# EAGLE board All Modules (EAGLE 9.5.1), part 1 of 2
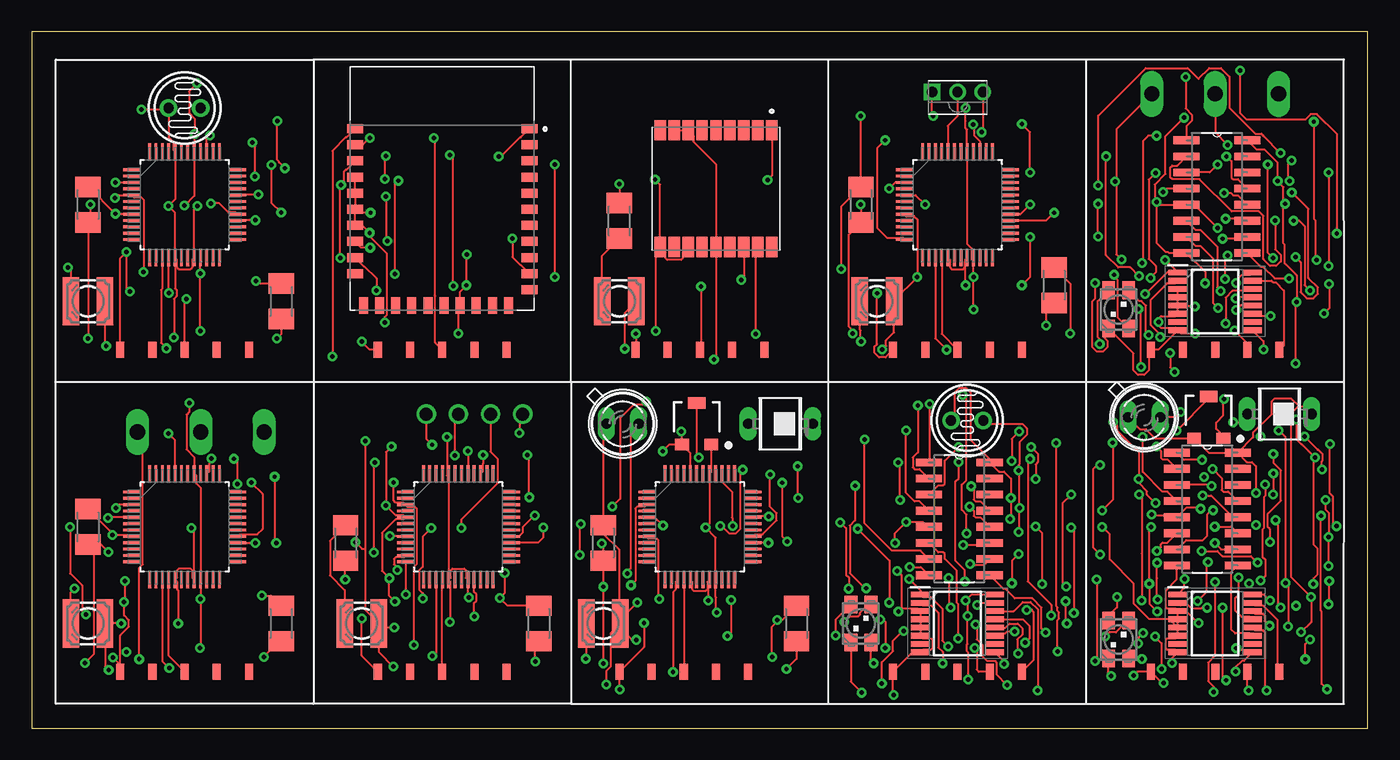
[diagram p5: board, top side]
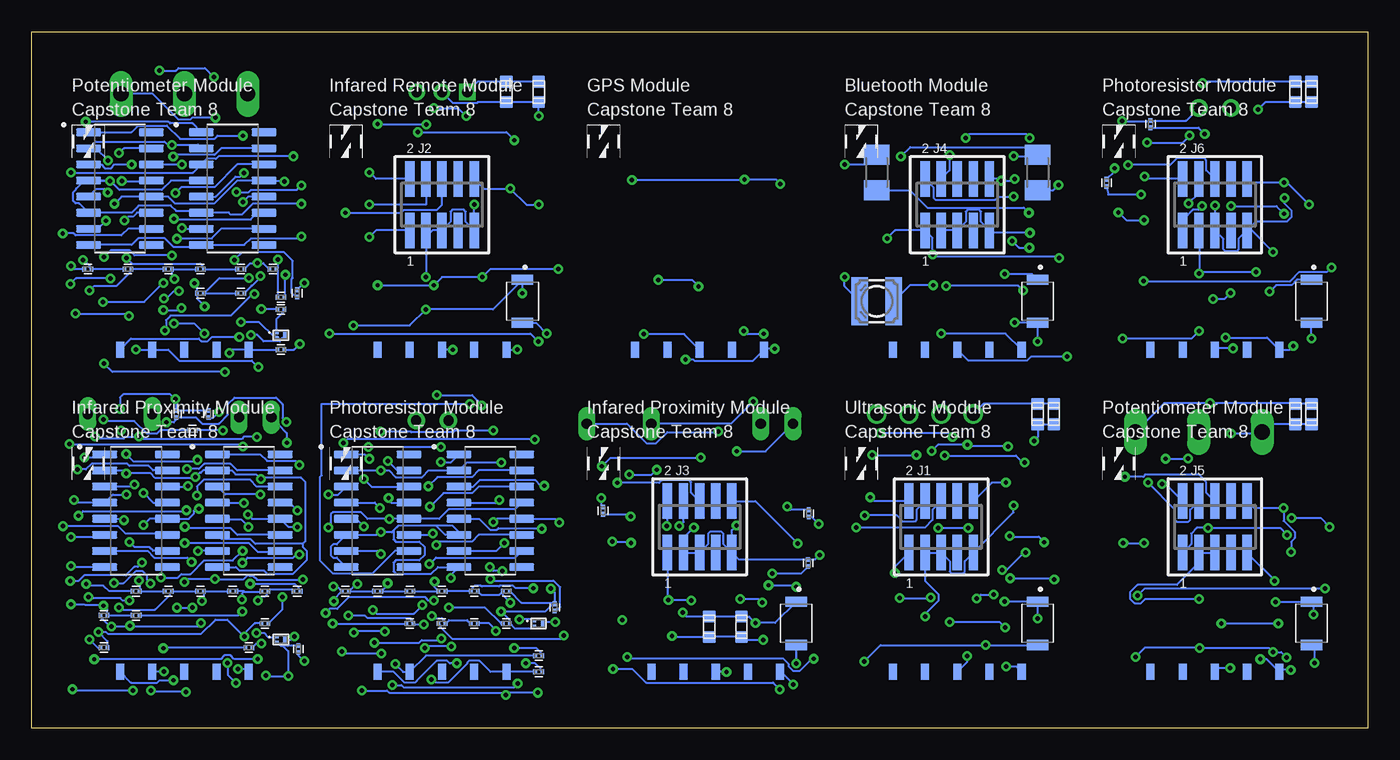
[diagram p6: board, bottom side, seen from below]

Size 105.39 x 54.91 mm. Coordinates in mm from the lower left corner, seen from the top.
Outline: 0,0 105.39,0 105.39,54.91 0,54.91 0,0
Copper layers (1*16): Top 0.035mm / dielectric 1.5mm / Bottom 0.035mm
Design rules "default": minimum track width 6mil, minimum drill 0.35mm, track to track 6mil, track to pad 6mil, pad to pad 6mil, via to via 6mil, smd to smd 6mil, copper to edge 40mil, drill to drill 6mil, minimum pad ring 10mil, minimum via ring 8mil, stop-mask expansion 4mil, vias tented up to drill 0mil, thermal gap 10mil

## Footprints (pad centres in the part's own frame; a part is rotated, then mirrored left to right if it is on the bottom)
C0603 = smd 1 x 0.95: 1 0,0.8; 2 0,-0.8
SFH482 = drill 0.813 long: A -1.27,0; K 1.27,0
BP104 = drill 0.813 long: A 0,2.54; K 0,-2.54
SOP65P640X110-16N = smd 1.475 x 0.45: 1 -2.938,2.275; 2 -2.938,1.625; 3 -2.938,0.975; 4 -2.938,0.325; 5 -2.938,-0.325; 6 -2.938,-0.975; 7 -2.938,-1.625; 8 -2.938,-2.275; 9 2.938,-2.275; 10 2.938,-1.625; 11 2.938,-0.975; 12 2.938,-0.325; 13 2.938,0.325; 14 2.938,0.975; 15 2.938,1.625; 16 2.938,2.275
FTSH-105-01-XXX-DV-K = smd 0.737 x 2.794: 1 -2.54,-2.032; 2 -2.54,2.032; 3 -1.27,-2.032; 4 -1.27,2.032; 5 0,-2.032; 6 0,2.032; 7 1.27,-2.032; 8 1.27,2.032; 9 2.54,-2.032; 10 2.54,2.032
NFSG036BT = smd 1.3 x 3.8: A 1.35,0; C -1.35,0
P-LCC4-0 = smd 1 x 1.4: 1 -0.787,-1.5; 2 -0.787,1.5; 3 0.787,1.5; 4 0.787,-1.5
TO46-VT200 = drill 0.8 pad 1.4: 1 -1.27,0; 2 1.27,0
DFN101X61X53-3N = smd 0.28 x 0.17: 1 -0.325,0.175; 2 -0.325,-0.175 | smd 0.28 x 0.52: 3 0.325,0
RESC0603X26N = smd 0.38 x 0.4: 1 -0.28,0; 2 0.28,0
M1206 = smd 1.6 x 2: 1 -1.4,0; 2 1.4,0
PC16S(NOSILK) = drill 1.2 long: 1A -5,6.5; 1E 5,6.5; 1S 0,6.5
SW_B3U-1000P = smd 0.8 x 1.7: 1 -1.7,0; 2 1.7,0
XDCR_TSL260R-LF = drill 0.8 square: 1 -2,0 | drill 0.8: 2 0,0; 3 2,0
TESEO-LIV3F = smd 0.9 x 1.6: 1 4.4,4.6; 2 3.3,4.6; 3 2.2,4.6; 4 1.1,4.6; 5 0,4.6; 6 -1.1,4.6; 7 -2.2,4.6; 8 -3.3,4.6; 9 -4.4,4.6; 10 -4.4,-4.6; 11 -3.3,-4.6; 12 -2.2,-4.6; 13 -1.1,-4.6; 14 0,-4.6; 15 1.1,-4.6; 16 2.2,-4.6; 17 3.3,-4.6; 18 4.4,-4.6
XCVR_CYBLE-012011-00 = smd 1.27 x 0.71: 1 6.875,4.72; 2 6.875,3.45; 3 6.875,2.18; 4 6.875,0.91; 5 6.875,-0.36; 6 6.875,-1.63; 7 6.875,-2.9; 8 6.875,-4.17; 9 6.875,-5.44; 10 6.875,-6.71; 11 6.875,-7.98; 22 -6.875,-6.71; 23 -6.875,-5.44; 24 -6.875,-4.17; 25 -6.875,-2.9; 26 -6.875,-1.63; 27 -6.875,-0.36; 28 -6.875,0.91; 29 -6.875,2.18; 30 -6.875,3.45; 31 -6.875,4.72 | smd 0.71 x 1.27: 12 5.22,-9.215; 13 3.95,-9.215; 14 2.68,-9.215; 15 1.41,-9.215; 16 0.14,-9.215; 17 -1.13,-9.215; 18 -2.4,-9.215; 19 -3.67,-9.215; 20 -4.94,-9.215; 21 -6.21,-9.215
SOIC127P600X175-16N = smd 2.057 x 0.61: 1 -4.801,8.89; 2 -4.801,7.62; 3 -4.801,6.35; 4 -4.801,5.08; 5 -4.801,3.81; 6 -4.801,2.54; 7 -4.801,1.27; 8 -4.801,0; 9 0,0; 10 0,1.27; 11 0,2.54; 12 0,3.81; 13 0,5.08; 14 0,6.35; 15 0,7.62; 16 0,8.89
SOIC127P600X175-16N' = smd 1.97 x 0.59: 1 -2.475,4.445; 2 -2.475,3.175; 3 -2.475,1.905; 4 -2.475,0.635; 5 -2.475,-0.635; 6 -2.475,-1.905; 7 -2.475,-3.175; 8 -2.475,-4.445; 9 2.475,-4.445; 10 2.475,-3.175; 11 2.475,-1.905; 12 2.475,-0.635; 13 2.475,0.635; 14 2.475,1.905; 15 2.475,3.175; 16 2.475,4.445
XCVR_HC-SR04(NOSILK) = drill 1.02: 1 -3.81,0; 2 -1.27,0; 3 1.27,0; 4 3.81,0
UEXT-SMD = smd 0.635 x 1.27 bottom: 1 -5.08,0; 3 -2.54,0; 5 0,0; 7 2.54,0; 9 5.08,0 | smd 0.635 x 1.27: 2 -5.08,0; 4 -2.54,0; 6 0,0; 8 2.54,0; 10 5.08,0
QFP50P900X900X160-48N = smd 1.321 x 0.229: 1 -4.191,2.743; 2 -4.191,2.261; 3 -4.191,1.753; 4 -4.191,1.245; 5 -4.191,0.762; 6 -4.191,0.254; 7 -4.191,-0.254; 8 -4.191,-0.762; 9 -4.191,-1.245; 10 -4.191,-1.753; 11 -4.191,-2.261; 12 -4.191,-2.743; 25 4.191,-2.743; 26 4.191,-2.261; 27 4.191,-1.753; 28 4.191,-1.245; 29 4.191,-0.762; 30 4.191,-0.254; 31 4.191,0.254; 32 4.191,0.762; 33 4.191,1.245; 34 4.191,1.753; 35 4.191,2.261; 36 4.191,2.743 | smd 0.229 x 1.321: 13 -2.743,-4.191; 14 -2.261,-4.191; 15 -1.753,-4.191; 16 -1.245,-4.191; 17 -0.762,-4.191; 18 -0.254,-4.191; 19 0.254,-4.191; 20 0.762,-4.191; 21 1.245,-4.191; 22 1.753,-4.191; 23 2.261,-4.191; 24 2.743,-4.191; 37 2.743,4.191; 38 2.261,4.191; 39 1.753,4.191; 40 1.245,4.191; 41 0.762,4.191; 42 0.254,4.191; 43 -0.254,4.191; 44 -0.762,4.191; 45 -1.245,4.191; 46 -1.753,4.191; 47 -2.261,4.191; 48 -2.743,4.191
TRIM_PVG3A200C01R00 = smd 1.1 x 0.9: 1 1.15,-1.65; 3 -1.15,-1.65 | smd 1.4 x 0.9: 2 0,1.65

## Placement (x,y rotation side)
C1  CAPACITORS-0603  [C0603]  26.04,24.76 0 bottom
C2  CAPACITORS-0603  [C0603]  24.76,24.76 0 bottom
C3  CAPACITORS-0603  [C0603]  67.94,50.16 0 bottom
C4  CAPACITORS-0603  [C0603]  65.41,50.16 0 bottom
C5  CAPACITORS-0603  [C0603]  51.94,8 0 bottom
C6  CAPACITORS-0603  [C0603]  49.4,8 0 bottom
C7  CAPACITORS-0603  [C0603]  5.71,24.76 0 bottom
C8  CAPACITORS-0603  [C0603]  4.45,24.76 0 bottom
C9  CAPACITORS-0603  [C0603]  5.71,50.16 0 bottom
C10  CAPACITORS-0603  [C0603]  4.45,50.16 0 bottom
D1  SFH482  [SFH482]  87.76,24.51 0 top
D2  BP104  [BP104]  98.42,24.76 90 top
D3  SFH482  [SFH482]  46.61,24 0 top
D4  BP104  [BP104]  59.05,24 90 top
IC1  74HC165PW,118  [SOP65P640X110-16N]  73.02,8.25 0 top
IC2  74HC165PW,118  [SOP65P640X110-16N]  93.34,33.66 0 top
IC3  74HC165PW,118  [SOP65P640X110-16N]  93.34,8.25 0 top
J1  FTSH-105-01-XXX-DV-K  [FTSH-105-01-XXX-DV-K]  33.66,15.87 0 bottom
J2  FTSH-105-01-XXX-DV-K  [FTSH-105-01-XXX-DV-K]  73.02,41.27 0 bottom
J3  FTSH-105-01-XXX-DV-K  [FTSH-105-01-XXX-DV-K]  52.7,15.87 0 bottom
J4  FTSH-105-01-XXX-DV-K  [FTSH-105-01-XXX-DV-K]  32.39,41.27 0 bottom
J5  FTSH-105-01-XXX-DV-K  [FTSH-105-01-XXX-DV-K]  12.07,15.87 0 bottom
J6  FTSH-105-01-XXX-DV-K  [FTSH-105-01-XXX-DV-K]  12.07,41.27 0 bottom
LED1  NFSG036BT  [NFSG036BT]  45.08,8.25 0 top
LED2  NFSG036BT  [NFSG036BT]  26.04,8.25 0 top
LED3  NFSG036BT  [NFSG036BT]  66.67,33.66 0 top
LED4  NFSG036BT  [NFSG036BT]  46.35,33.66 0 top
LED5  NFSG036BT  [NFSG036BT]  38.73,33.66 0 bottom
LED6  NFSG036BT  [NFSG036BT]  4.45,8.25 0 top
LED7  NFSG036BT  [NFSG036BT]  4.45,33.66 0 top
LED8  LSG-T676  [P-LCC4-0]  85.72,6.98 0 top
LED9  LSG-T676  [P-LCC4-0]  85.72,33.02 0 top
LED10  LSG-T676  [P-LCC4-0]  65.41,8.25 0 top
PH1  VT20N1  [TO46-VT200]  73.79,24.26 0 top
PH2  VT20N1  [TO46-VT200]  12.07,48.89 0 top
Q1  MMBT3904LP-7  [DFN101X61X53-3N]  85.72,6.98 0 bottom
Q2  MMBT3904LP-7  [DFN101X61X53-3N]  65.41,8.25 0 bottom
Q3  MMBT3904LP-7  [DFN101X61X53-3N]  85.72,30.99 0 bottom
R1  ERJ-1RHD3601C  [RESC0603X26N]  88.9,36.19 0 bottom
R2  ERJ-1RHD3601C  [RESC0603X26N]  75.56,8.25 0 bottom
R3  ERJ-1RHD3601C  [RESC0603X26N]  73.02,8.25 0 bottom
R4  ERJ-1RHD3601C  [RESC0603X26N]  65.41,5.71 0 bottom
R5  ERJ-1RHD3601C  [RESC0603X26N]  67.94,8.25 0 bottom
R6  1k  [M1206]  46.35,40 270 top
R7  1k  [M1206]  38.73,43.81 90 bottom
R8  ERJ-1RHD3601C  [RESC0603X26N]  70.48,8.25 180 bottom
R9  ERJ-1RHD3601C  [RESC0603X26N]  91.44,24.76 270 bottom
R10  ERJ-1RHD3601C  [RESC0603X26N]  93.98,24.76 270 bottom
R11  ERJ-1RHD3601C  [RESC0603X26N]  86.99,8.25 0 bottom
R12  ERJ-1RHD3601C  [RESC0603X26N]  99.69,6.35 0 bottom
R13  ERJ-1RHD3601C  [RESC0603X26N]  88.27,6.35 180 bottom
R15  ERJ-1RHD3601C  [RESC0603X26N]  80.64,10.79 0 bottom
R16  ERJ-1RHD3601C  [RESC0603X26N]  78.1,10.79 180 bottom
R17  ERJ-1RHD3601C  [RESC0603X26N]  75.56,10.79 180 bottom
R18  ERJ-1RHD3601C  [RESC0603X26N]  70.48,10.79 0 bottom
R19  ERJ-1RHD3601C  [RESC0603X26N]  67.94,10.79 180 bottom
R20  PC16S(NOSILK)  [PC16S(NOSILK)]  93.34,56.52 180 top
R21  ERJ-1RHD3601C  [RESC0603X26N]  73.02,10.79 180 bottom
R22  1k  [M1206]  24.76,14.61 90 top
R23  ERJ-1RHD3601C  [RESC0603X26N]  65.41,4.45 0 bottom
R24  ERJ-1RHD3601C  [RESC0603X26N]  92.07,36.19 180 bottom
R25  ERJ-1RHD3601C  [RESC0603X26N]  94.61,36.19 0 bottom
R26  ERJ-1RHD3601C  [RESC0603X26N]  97.79,36.19 0 bottom
R27  ERJ-1RHD3601C  [RESC0603X26N]  88.9,34.29 180 bottom
R28  ERJ-1RHD3601C  [RESC0603X26N]  92.07,34.29 0 bottom
R29  ERJ-1RHD3601C  [RESC0603X26N]  100.96,36.19 0 bottom
R30  ERJ-1RHD3601C  [RESC0603X26N]  85.72,29.85 180 bottom
R31  ERJ-1RHD3601C  [RESC0603X26N]  89.53,10.79 0 bottom
R32  ERJ-1RHD3601C  [RESC0603X26N]  94.61,10.79 0 bottom
R33  ERJ-1RHD3601C  [RESC0603X26N]  84.45,10.79 180 bottom
R34  ERJ-1RHD3601C  [RESC0603X26N]  97.16,10.79 0 bottom
R35  ERJ-1RHD3601C  [RESC0603X26N]  92.07,10.79 0 bottom
R36  ERJ-1RHD3601C  [RESC0603X26N]  86.99,10.79 180 bottom
R37  ERJ-1RHD3601C  [RESC0603X26N]  97.16,8.89 0 bottom
R38  ERJ-1RHD3601C  [RESC0603X26N]  99.69,8.89 0 bottom
R39  ERJ-1RHD3601C  [RESC0603X26N]  92.71,23.5 180 bottom
R40  ERJ-1RHD3601C  [RESC0603X26N]  85.72,33.97 0 bottom
R41  ERJ-1RHD3601C  [RESC0603X26N]  85.72,33.02 0 bottom
R42  ERJ-1RHD3601C  [RESC0603X26N]  86.36,36.19 0 bottom
R43  1k  [M1206]  60.32,8.25 90 top
R44  1k  [M1206]  45.08,14.61 90 top
R45  1k  [M1206]  40,8.25 90 top
R46  1k  [M1206]  80.64,34.92 90 top
R47  1k  [M1206]  65.41,41.27 90 top
R48  1k  [M1206]  26.04,43.81 90 bottom
R49  ERJ-1RHD3601C  [RESC0603X26N]  44.15,13.02 270 bottom
R50  ERJ-1RHD3601C  [RESC0603X26N]  44.1,16.94 90 bottom
R51  ERJ-1RHD3601C  [RESC0603X26N]  60.32,17.14 270 bottom
R52  1k  [M1206]  19.68,8.25 90 top
R53  1k  [M1206]  4.45,15.87 90 top
R54  PC16S(NOSILK)  [PC16S(NOSILK)]  13.33,29.85 180 top
R55  ERJ-1RHD3601C  [RESC0603X26N]  17.14,47.62 270 bottom
R56  ERJ-1RHD3601C  [RESC0603X26N]  84.35,6.24 90 bottom
R57  1k  [M1206]  19.68,33.66 90 top
R58  1k  [M1206]  4.45,41.27 90 top
R59  ERJ-1RHD3601C  [RESC0603X26N]  64.13,9.53 90 bottom
R60  ERJ-1RHD3601C  [RESC0603X26N]  84.45,34.29 90 bottom
R61  ERJ-1RHD3601C  [RESC0603X26N]  20.61,43 270 bottom
S1  B3U-1000P  [SW_B3U-1000P]  66.67,33.66 270 bottom
S2  B3U-1000P  [SW_B3U-1000P]  26.04,33.66 270 bottom
S3  B3U-1000P  [SW_B3U-1000P]  4.45,8.25 270 bottom
S5  B3U-1000P  [SW_B3U-1000P]  4.45,33.66 270 bottom
S6  B3U-1000P  [SW_B3U-1000P]  26.04,8.25 270 bottom
S7  B3U-1000P  [SW_B3U-1000P]  45.08,8.25 270 bottom
U1  TSL260R-LF  [XDCR_TSL260R-LF]  73.02,50.16 0 top
U2  TESEO-LIV3F  [TESEO-LIV3F]  53.97,42.55 0 top
U3  CYBLE-012011-00  [XCVR_CYBLE-012011-00]  32.39,42.55 0 top
U4  SN74HC148D  [SOIC127P600X175-16N]  95.12,12.83 0 top
U5  MAX964ESET  [SOIC127P600X175-16N']  97.16,17.14 0 bottom
U6  MAX964ESET  [SOIC127P600X175-16N']  88.27,17.14 0 bottom
U7  SN74HC148D  [SOIC127P600X175-16N]  75.56,12.07 0 top
U8  MAX964ESET  [SOIC127P600X175-16N']  78.1,17.14 0 bottom
U9  MAX964ESET  [SOIC127P600X175-16N']  69.21,17.14 0 bottom
U10  SN74HC148D  [SOIC127P600X175-16N]  95.88,37.47 0 top
U11  MAX964ESET  [SOIC127P600X175-16N']  98.42,42.55 0 bottom
U12  MAX964ESET  [SOIC127P600X175-16N']  89.53,42.55 0 bottom
U13  HC-SR04(NOSILK)  [XCVR_HC-SR04(NOSILK)]  34.92,24.76 180 top
U$1  UEXT-SMD  [UEXT-SMD]  93.34,4.45 0 top
U$2  UEXT-SMD  [UEXT-SMD]  93.34,29.85 0 top
U$3  UEXT-SMD  [UEXT-SMD]  73.02,4.45 0 top
U$4  LPC11C24FBD48/301  [QFP50P900X900X160-48N]  73.02,41.27 0 top
U$5  UEXT-SMD  [UEXT-SMD]  73.02,29.85 0 top
U$6  LPC11C24FBD48/301  [QFP50P900X900X160-48N]  52.7,15.87 0 top
U$7  LPC11C24FBD48/301  [QFP50P900X900X160-48N]  33.66,15.87 0 top
U$8  UEXT-SMD  [UEXT-SMD]  51.44,4.45 0 top
U$9  UEXT-SMD  [UEXT-SMD]  52.7,29.85 0 top
U$10  UEXT-SMD  [UEXT-SMD]  32.39,4.45 0 top
U$11  LPC11C24FBD48/301  [QFP50P900X900X160-48N]  12.07,15.87 0 top
U$12  UEXT-SMD  [UEXT-SMD]  32.39,29.85 0 top
U$13  UEXT-SMD  [UEXT-SMD]  12.07,4.45 0 top
U$14  LPC11C24FBD48/301  [QFP50P900X900X160-48N]  12.07,41.27 0 top
U$15  UEXT-SMD  [UEXT-SMD]  12.07,29.85 0 top
VR1  PVG3A200C01R00  [TRIM_PVG3A200C01R00]  92.84,24.51 0 top
VR2  PVG3A200C01R00  [TRIM_PVG3A200C01R00]  52.45,24 0 top